# Altium schematic sheet Pg1.SchDoc
size A3; SheetNumber: 1; SheetTotal: 7; SPICEModelCacheZVIZADMF: <root> / <DocumentId>ZVIZADMF</DocumentId> / </root>
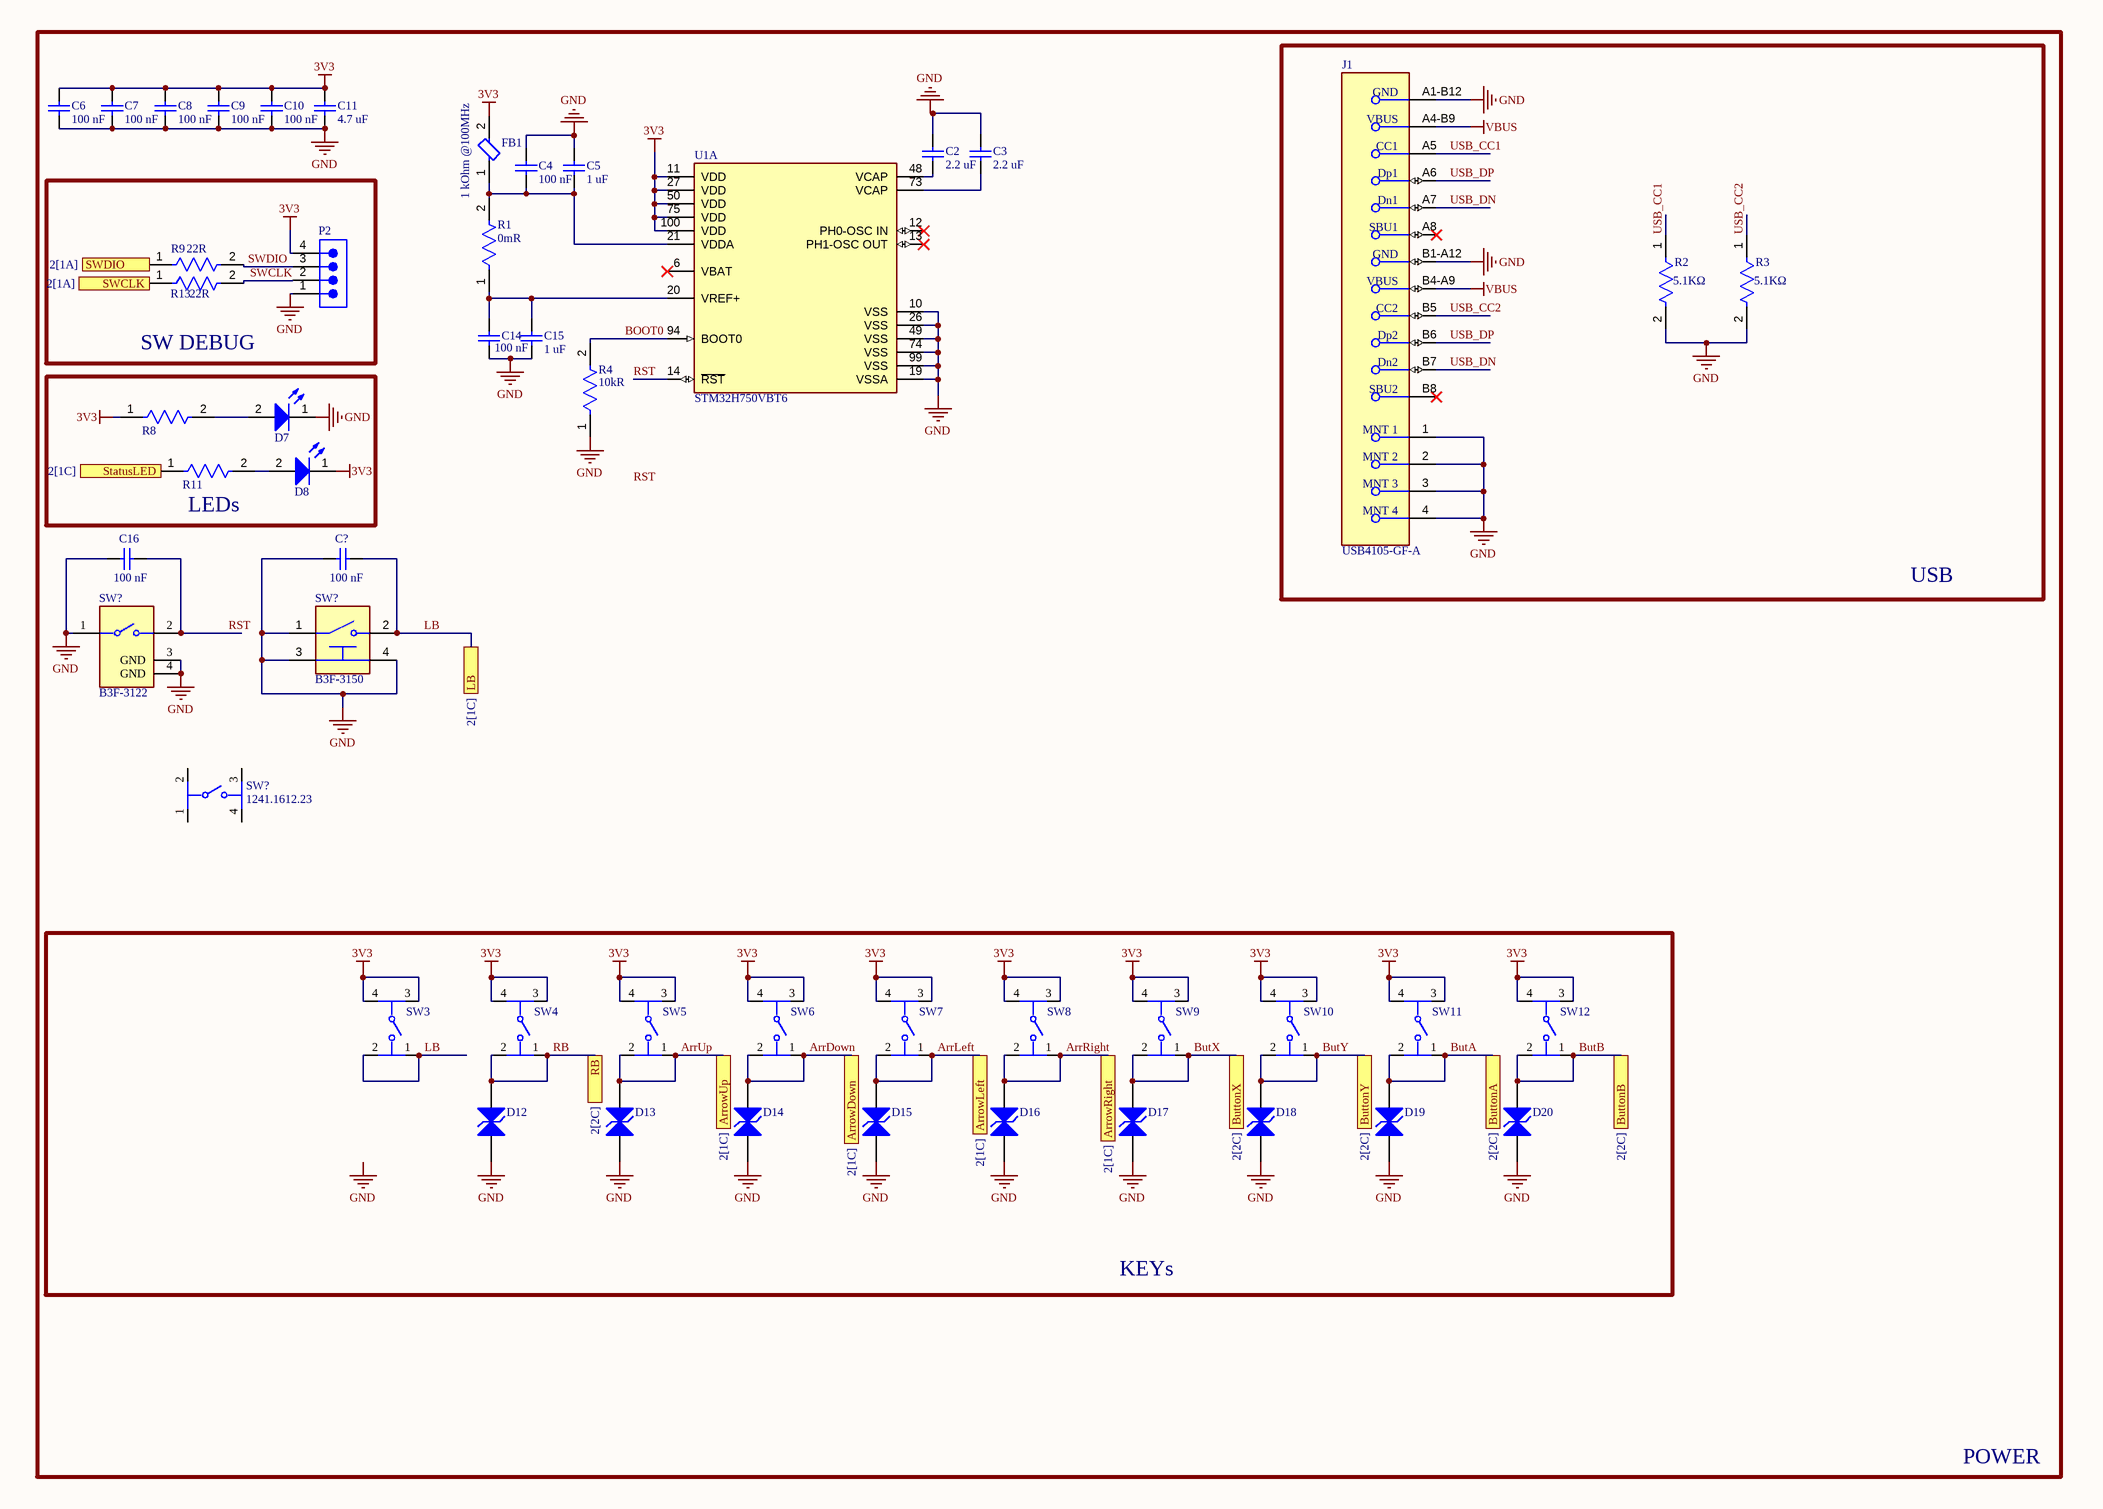
[diagram p0: Pg1.SchDoc]

## Parts
(Parts that share a designator on the sheet are numbered #1, #2 ... from top to bottom, then left to right.)
C2  value 2.2 uF  [CAPC2013X135X45LL10T25]  (hidden comment: GRM21BR60J225KA01K)
C3  value 2.2 uF  [CAPC2013X135X45LL10T25]  (hidden comment: GRM21BR60J225KA01K)
C4  value 100 nF  [CAPC2013X145X50LL20T25]  (hidden comment: C0805C104K9RACTU)
C5  value 1 uF  [CAPC2013X135X45LL10T25]  (hidden comment: GRM21BR60J225KA01K)
C6  value 100 nF  [CAPC2013X145X50LL20T25]  (hidden comment: C0805C104K9RACTU)
C7  value 100 nF  [CAPC2013X145X50LL20T25]  (hidden comment: C0805C104K9RACTU)
C8  value 100 nF  [CAPC2013X145X50LL20T25]  (hidden comment: C0805C104K9RACTU)
C9  value 100 nF  [CAPC2013X145X50LL20T25]  (hidden comment: C0805C104K9RACTU)
C10  value 100 nF  [CAPC2013X145X50LL20T25]  (hidden comment: C0805C104K9RACTU)
C11  value 4.7 uF  [CAPC2013X145X50NL20T25]  (hidden comment: C0805C475K9PACTU)
C14  value 100 nF  [CAPC2013X145X50LL20T25]  (hidden comment: C0805C104K9RACTU)
C15  value 1 uF  [CAPC2013X135X45LL10T25]  (hidden comment: GRM21BR60J225KA01K)
C16  value 100 nF  [CAPC2013X145X50LL20T25]  (hidden comment: C0805C104K9RACTU)
C?  value 100 nF  [CAPC2013X145X50LL20T25]  (hidden comment: C0805C104K9RACTU)
D7  150080BS75000  [WL-SMCW_0805_150080xx75000]  (value not drawn)
D8  150080BS75000  [WL-SMCW_0805_150080xx75000]  (value not drawn)
D12  SMAJ5.0CA-E3/5A  [VISH-DO-214AC-2_N]  (value not drawn)
D13  SMAJ5.0CA-E3/5A  [VISH-DO-214AC-2_N]  (value not drawn)
D14  SMAJ5.0CA-E3/5A  [VISH-DO-214AC-2_N]  (value not drawn)
D15  SMAJ5.0CA-E3/5A  [VISH-DO-214AC-2_N]  (value not drawn)
D16  SMAJ5.0CA-E3/5A  [VISH-DO-214AC-2_N]  (value not drawn)
D17  SMAJ5.0CA-E3/5A  [VISH-DO-214AC-2_N]  (value not drawn)
D18  SMAJ5.0CA-E3/5A  [VISH-DO-214AC-2_N]  (value not drawn)
D19  SMAJ5.0CA-E3/5A  [VISH-DO-214AC-2_N]  (value not drawn)
D20  SMAJ5.0CA-E3/5A  [VISH-DO-214AC-2_N]  (value not drawn)
FB1  value 1 kOhm @100MHz  [FP-BLM21-0_2-t0_85-e0_5-d-IPC_A]  (hidden comment: BLM21SP102SN1D)
J1  USB4105-GF-A  [FP-USB4105-GF-A-MFG]
P2  TSW-104-08-L-S  [SMTC-TSW-104-08-X-S]  (value not drawn)
R1  Resistance: 0mR  [FP-RK73Z2A-MFG]  (hidden comment: RK73Z2ATTD)
R2  value 5.1KΩ  [FP-RT0805-MFG]  (hidden comment: RT0805DRE075K1L)
R3  Resistance: 5.1KΩ  [FP-RT0805-MFG]  (hidden comment: RT0805DRE075K1L)
R4  Resistance: 10kR  [FP-MCU0805-IPC_C]  (hidden comment: MCU08050D1002BP100)
R8  RT0805CRE075K1L  [FP-RT0805-MFG]  (value not drawn)
R9  Resistance: 22R  [FP-RG2012-IPC_B]  (hidden comment: RG2012Q-220-D-T5)
R11  RT0805CRE075K1L  [FP-RT0805-MFG]  (value not drawn)
R13  Resistance: 22R  [FP-RG2012-IPC_B]  (hidden comment: RG2012Q-220-D-T5)
SW3  1571626-8  [FP-1571626-8-MFG]  (value not drawn)
SW4  1571626-8  [FP-1571626-8-MFG]  (value not drawn)
SW5  1571626-8  [FP-1571626-8-MFG]  (value not drawn)
SW6  1571626-8  [FP-1571626-8-MFG]  (value not drawn)
SW7  1571626-8  [FP-1571626-8-MFG]  (value not drawn)
SW8  1571626-8  [FP-1571626-8-MFG]  (value not drawn)
SW9  1571626-8  [FP-1571626-8-MFG]  (value not drawn)
SW10  1571626-8  [FP-1571626-8-MFG]  (value not drawn)
SW11  1571626-8  [FP-1571626-8-MFG]  (value not drawn)
SW12  1571626-8  [FP-1571626-8-MFG]  (value not drawn)
SW?#1  B3F-3122  [FP-B3F-3122-MFG]
SW?#2  B3F-3150  [FP-B3F-3150-MFG]
SW?#3  1241.1612.23  [FP-1241_1612_23-MFG]
U1  STM32H750VBT6  [FP-LQFP100-1L-MFG]  (part A of 3)

## Blocks framed on the sheet
USB: J1 R2 R3
SW DEBUG: P2 R9 R13
LEDs: D7 D8 R8 R11
KEYs: D12-D20 SW3-SW12

## Ports
ArrowDown (see 2[1C]), ArrowLeft (see 2[1C]), ArrowRight (see 2[1C]), ArrowUp (see 2[1C]), ButtonA (see 2[2C]), ButtonB (see 2[2C]), ButtonX (see 2[2C]), ButtonY (see 2[2C]), LB (see 2[1C]), RB (see 2[2C]), StatusLED (see 2[1C]), SWCLK (see 2[1A]), SWDIO (see 2[1A])

## Nets
3V3: C6.2 C7.2 C8.2 C9.2 C10.2 C11.2 D8.1(K) FB1.2 P2.4 R8.1 SW3.3 SW3.4 SW4.3 SW4.4 SW5.3 SW5.4 SW6.3 SW6.4 SW7.3 SW7.4 SW8.3 SW8.4 SW9.3 SW9.4 SW10.3 SW10.4 SW11.3 SW11.4 SW12.3 SW12.4 U1.11(VDD) U1.27(VDD) U1.50(VDD) U1.75(VDD) U1.100(VDD)
GND: C2.2 C3.2 C4.2 C5.2 C6.1 C7.1 C8.1 C9.1 C10.1 C11.1 C14.1 C15.1 C16.1 C?.1 D7.1(K) D12.2(A2) D13.2(A2) D14.2(A2) D15.2(A2) D16.2(A2) D17.2(A2) D18.2(A2) D19.2(A2) D20.2(A2) J1.1(MNT_1) J1.2(MNT_2) J1.3(MNT_3) J1.4(MNT_4) J1.A1-B12(GND) J1.B1-A12(GND) P2.1 R2.2 R3.2 R4.1 SW?#1.1 SW?#1.3(GND) SW?#1.4(GND) SW?#2.1 SW?#2.3(MNT_1) SW?#2.4(MNT_2) U1.10(VSS) U1.19(VSSA) U1.26(VSS) U1.49(VSS) U1.74(VSS) U1.99(VSS)
VBUS: J1.A4-B9(VBUS) J1.B4-A9(VBUS)
ArrDown: D14.1(A1) SW6.1 SW6.2 ; port ArrowDown
ArrLeft: D15.1(A1) SW7.1 SW7.2 ; port ArrowLeft
ArrRight: D16.1(A1) SW8.1 SW8.2 ; port ArrowRight
ArrUp: D13.1(A1) SW5.1 SW5.2 ; port ArrowUp
BOOT0: R4.2 U1.94(BOOT0)
ButA: D19.1(A1) SW11.1 SW11.2 ; port ButtonA
ButB: D20.1(A1) SW12.1 SW12.2 ; port ButtonB
ButX: D17.1(A1) SW9.1 SW9.2 ; port ButtonX
ButY: D18.1(A1) SW10.1 SW10.2 ; port ButtonY
LB: C?.2 SW3.1 SW3.2 SW?#2.2 ; port LB
RB: D12.1(A1) SW4.1 SW4.2 ; port RB
RST: C16.2 SW?#1.2 U1.14(~{RST})
StatusLED: R11.1 ; port StatusLED
SWCLK: P2.2 R13.2
SWCLK: R13.1 ; port SWCLK  [a separate net that carries the same name]
SWDIO: P2.3 R9.2
SWDIO: R9.1 ; port SWDIO  [a separate net that carries the same name]
USB_CC1: J1.A5(CC1) R2.1
USB_CC2: J1.B5(CC2) R3.1
USB_DN: J1.A7(Dn1) J1.B7(Dn2)
USB_DP: J1.A6(Dp1) J1.B6(Dp2)
NetC2_1: C2.1 U1.48(VCAP)
NetC3_1: C3.1 U1.73(VCAP)
NetC4_1: C4.1 C5.1 FB1.1 R1.2 U1.21(VDDA)
NetC14_2: C14.2 C15.2 R1.1 U1.20(VREF+)
NetD7_2: D7.2(A) R8.2
NetD8_2: D8.2(A) R11.2

Not connected (* = marked no-connect by the designer): J1 A8(SBU1)* B8(SBU2)*; SW?#3 1 2 3 4; U1 6(VBAT)* 12(PH0-OSC_IN)* 13(PH1-OSC_OUT)*

## Notes on the sheet
- POWER
- Labels drawn without touching a wire or pin: GND, RST
- DWG NO:
- REV:
- THIS DOCUMENT AND THE DATA DISCLOSED HEREIN OR
- HEREWITH IS THE PROPERTY OF ALTIUM LIMITED AND MAY
- BE FREELY DISTRIBUTED IN WHOLE. NO RIGHTS ARE
- RESERVED OR EXPRESS OR IMPLIED WARANTEE GIVEN.
- REVISION
- DESCRIPTION
- DATE
- APPROVED
- ENG:
- APPROVALS
- PROJECT
- DSN:
- CHK:
- REFERENCE DOCUMENTS
- PROJECT REVISION:
- TITLE
- DOCUMENT REVISION:
- DESIGN ITEM:
- BOM:
- FAB DWG:
- PCB DWG:
- ASSY DWG:
- SCALE:
- A2
- SIZE
- CAGE CODE
- FILE NAME
- DWG NO.
- SHEET
- OF
- REV

## Library data of the parts
C2 C3 C5 C15 = CMP-2007-03531-1: Manufacturer: Murata; Part Number: GRM21BR60J225KA01K
C4 C6-C10 C14 C16 C? = CMP-1036-04391-2: Manufacturer: Kemet; Part Number: C0805C104K9RACTU
C11 = CMP-2007-01009-1: Manufacturer: Kemet; Part Number: C0805C475K9PACTU
D7 D8 = CMP-1426-00008-7: Led, Blue, 470 Nm, 3.2 V, 30 Ma, 145 Mcd Rohs Compliant: Yes; Dominant Wavelength: 470nm; Max Junction Temperature (Tj): 95°C; Power Dissipation: 105mW; Peak Wavelength: 465nm; Max Reverse Voltage (DC): 5V; Forward Current: 100mA; Test Current: 20mA; Luminous Intensity: 145mcd; Lens Style: Clear, Rectangular; Viewing Angle: 140°; Forward Voltage: 3.2V; Color: Blue; Height: 700µm; Case Code (Imperial): 0805; Width: 1.25mm; REACH SVHC: Unknown; Case/Package: 0805; Lead Free: Lead Free; Mount: Surface Mount; Packaging: Tape and Reel; RoHS: Compliant; Reverse Voltage: 5V; Min Operating Temperature: -40°C; Case Code (Metric): 2012; Wavelength: 470nm; Max Operating Temperature: 85°C; Length: 2mm
D12-D20 = CMP-0548-00276-2: Transient Voltage Suppressor, 6.40 to 231 V, 5 V Stand-off Voltage, Bi-Directional, -55 to 155 degC, 2-pin DO-214AC, Pb-Free, Tape and Reel; Manufacturer: Vishay Semiconductor; PPPM (W): 400, 300; VBR Bi-Directional (V): 6.4 to 231; ID (uA): 1600; IFSM: 40 A; VWM (V): 5; RoHS: TRUE; Operating Junction and Storage Temperature Range: -55 to 150 degC; Packing: Tape and Reel; ComponentLink1URL: http://www.vishay.com/; Mounting Technology: Surface Mount; ComponentLink2URL: http://www.vishay.com/docs/88390/smaj50a.pdf; PartNumber: SMAJ5.0CA-E3/5A; PackageReference: DO-214AC-2; ComponentLink1Description: Manufacturer URL; ComponentLink3Description: Package Specification; ComponentLink2Description: Datasheet; PackageDescription: 2-Pin DO-214AC (SMA), Body 4.245 x 2.665 mm; DatasheetVersion: 12/8/2013; ComponentLink3URL: http://www.vishay.com/docs/88390/smaj50a.pdf
FB1 = CMP-06046-001860-1: Chip Ferrite Bead, 0805, 1000Ω @ 100MHz, 0.12Ω, 25%, 1.6A; RoHS Compliant: Yes
J1 = CMP-245163-000001-1: CONN RCPT USB2.0 TYPEC 5A; Manufacturer: GCT; Voltage Rating: 20V; Is Female: yes; Current Rating: 5/6.25/1.25/0.25A; Number Of Contacts: 16; Conn Orientation: Right Angle; Device Class L1: Connectors; Category: Conn; Lead Free: Yes; RoHS: TRUE; Temperature Range High: +85°C; Digikey Description: CONN RCPT USB2.0 TYPEC 5A; Device Class L3: unset; ComponentLink2Description: Datasheet; Manufacturer Part Number: USB4105-GF-A; Package: 0; Usb Standard: USB 2.0; Device Class L2: USB Connectors; Automotive: No; Temperature Range Low: -40°C; Height: 3.46mm; Temperature: -40°C to +85°C; Contact Material: Gold,Nickel; ComponentLink2URL: https://gct.co/files/drawings/usb4105.pdf; Octopart: https://octopart.com/usb4105-gf-a-gct-106627878
P2 = CMP-1024-00358-1: 0.025" SQ Post Header, Through-hole, Vertical, -55 to 125 degC, 2.54 mm Pitch, 4-Pin, Male, RoHS; Manufacturer: Samtec; Pitch: 2.54 mm; PartNumber: TSW-104-08-L-S; RoHS: True; Temperature Range: -55 to 125 degC; PackageDescription: .025[0.64] SQ. Post Terminal Strip Assembly; Orientation: Vertical; ComponentLink2URL: http://www.samtec.com/documents/webfiles/pdf/TSW_TH.PDF; ComponentLink1Description: Manufacturer URL; ComponentLink2Description: Datasheet; PackageVersion: DM, 8/1988; ComponentLink3URL: http://www.samtec.com/documents/webfiles/cpdf/TSW-XXX-XX-XXX-X-XX-XXX-MKT.pdf; Mounting Technology: Through-hole; PackageReference: TSW-104-08-X-S; ComponentLink3Description: Package Specification; ComponentLink1URL: http://www.samtec.com; DatasheetVersion: F-214
R1 = CMP-2000-05462-2: RES 0 OHM JUMPER 0805; Temperature Coefficient: 400ppm/°C; Tolerance: 1%; Power Rating: 2W; Min Operating Temperature: -55°C; Termination: SMD/SMT; Width: 1.25mm; Series: RK73Z; Lead Free: Lead Free; Case Code (Metric): 2012; Military Standard: Not; Case Code (Imperial): 0805; Packaging: Tape and Reel; Max Operating Temperature: 155°C; Package Quantity: 5000; Height: 0.5mm; RoHS Compliant: Yes; Depth: 1.25mm; Length: 2mm; Resistor Type: Thick Film; Case/Package: 0805; Construction: Rectangular
R2 = CMP-03412-022555-1: RES SMD 5.1K OHM 0.5% 1/8W 0805; Manufacturer: Yageo; Temperature Coefficient: 50 ppm/°C; Tolerance: 0.01; Voltage Rating: 150V; Power Rating: 0.125W; Manufacturer Part Number: RT0805DRE075K1L; Device Class L3: Chip SMD Resistors; Digikey Description: RES SMD 5.1K OHM 0.5% 1/8W 0805; Series: RT; ComponentLink2URL: http://www.yageo.com/documents/recent/PYu-RT_1-to-0.01_RoHS_L_9.pdf; Lead Free: Yes; Octopart: https://octopart.com/rt0805dre075k1l-yageo-1467682; ComponentLink2Description: Datasheet; Temperature Range High: +155°C; Temperature Range Low: -55°C; Resistance: 5.1KΩ; Composition: Thin Film; Height: 0.6mm; Device Class L2: Resistors; Ipc Land Pattern Name: RESC200125X50; Package: RT0805; Category: Res; Footprint Url: http://www.yageo.com/exep/pages/download/literatures/PYu-R_Mount_10.pdf; Temperature: -55°C to +155°C; RoHS: TRUE; Automotive: No; Device Class L1: Passive Components
R3 = CMP-03412-022555-1: RES SMD 5.1K OHM 0.5% 1/8W 0805; Manufacturer: Yageo; Temperature Coefficient: 50 ppm/°C; Value: 5.1KΩ; Tolerance: 0.01; Voltage Rating: 150V; Power Rating: 0.125W; Manufacturer Part Number: RT0805DRE075K1L; Device Class L3: Chip SMD Resistors; Digikey Description: RES SMD 5.1K OHM 0.5% 1/8W 0805; Series: RT; ComponentLink2URL: http://www.yageo.com/documents/recent/PYu-RT_1-to-0.01_RoHS_L_9.pdf; Lead Free: Yes; Octopart: https://octopart.com/rt0805dre075k1l-yageo-1467682; ComponentLink2Description: Datasheet; Temperature Range High: +155°C; Temperature Range Low: -55°C; Composition: Thin Film; Height: 0.6mm; Device Class L2: Resistors; Ipc Land Pattern Name: RESC200125X50; Package: RT0805; Category: Res; Footprint Url: http://www.yageo.com/exep/pages/download/literatures/PYu-R_Mount_10.pdf; Temperature: -55°C to +155°C; RoHS: TRUE; Automotive: No; Device Class L1: Passive Components
R4 = CMP-02407-010458-1: RES 1.05K OHM 0.5% 1/5W 0805; Power Rating: 125mW; Voltage Rating (DC): 100V; Tolerance: 0.1%; Temperature Coefficient: 25ppm/°C; Min Operating Temperature: -55°C; Military Standard: Not; Composition: Thin Film; Max Power Dissipation: 125mW; Lead Free: Lead Free; Case/Package: 0805; Contact Plating: Tin; Depth: 1.25mm; Number of Terminations: 2; Height: 0.022inch; Package Quantity: 1000; Max Operating Temperature: 125°C; Packaging: Tape and Reel; Mount: Surface Mount; Radiation Hardening: No; Length: 2mm; Width: 0.049inch
R8 R11 = CMP-03412-005622-1: RES SMD 5.1K OHM 0.25% 1/8W 0805; Manufacturer: Yageo; Tolerance: 0.005; Value: 5.1KΩ; Voltage Rating: 150V; Power Rating: 0.125W; Temperature Coefficient: 50 ppm/°C; Temperature Range Low: -55°C; Device Class L3: Chip SMD Resistors; Series: RT; Automotive: No; Height: 0.6mm; Lead Free: Yes; Category: Res; ComponentLink2Description: Datasheet; ComponentLink2URL: http://www.yageo.com/documents/recent/PYu-RT_1-to-0.01_RoHS_L_9.pdf; Composition: Thin Film; Temperature Range High: +155°C; Device Class L1: Passive Components; Footprint Url: http://www.yageo.com/exep/pages/download/literatures/PYu-R_Mount_10.pdf; Package: RT0805; Device Class L2: Resistors; Resistance: 5.1KΩ; RoHS: TRUE; Digikey Description: RES SMD 5.1K OHM 0.25% 1/8W 0805; Temperature: -55°C to +155°C; Manufacturer Part Number: RT0805CRE075K1L; Octopart: https://octopart.com/rt0805cre075k1l-yageo-1479639; Ipc Land Pattern Name: RESC200125X50
R9 R13 = CMP-28537-003551-1: Automotive Metal Thin Film Chip Resistor, 0805, 22Ω, 0.5%, 50ppm/°C, 0.125W, 150V; Power Rating: 125mW; Length: 2mm; Features: Automotive AEC-Q200; Tolerance: 0.5%; Packaging: Tape and Reel; Case/Package: 0805; Termination: SMD/SMT; Weight: 0.000194oz; Height: 0.4mm; Voltage Rating (DC): 150V; Voltage Rating: 150V; RoHS Compliant: Yes; Case Code (Imperial): 0805; Lead Free: Lead Free; Min Operating Temperature: -55°C; Resistor Type: Thin Film; Series: RG; Max Power Dissipation: 125mW; Max Operating Temperature: 155°C; Width: 1.2mm; Temperature Coefficient: 50ppm/°C; Case Code (Metric): 2012; Number of Terminations: 2
SW3-SW12 = CMP-03407-000021-1: SWITCH TACTILE SPST-NO 0.05A 12V; Max Current Rating: 50mA; Actuator Material: Nylon; Throw Configuration: SPST; Actuator Length: 0.711mm; Actuator Type: Standard; Operating Force: 1.57N; Voltage Rating (DC): 24V; Switch Function: Off-Mom; Illumination Type: Non-Illuminated; Mount: Surface Mount; Contact Plating: Silver; Contact Material: Stainless Steel; Depth: 8.2mm; Termination: Gull Wing; Type: Switch; Length: 6.2mm; Max Operating Temperature: 85°C; ELV: Compliant; Radiation Hardening: No; Orientation: Straight; Series: Extended Life; Packaging: Tape and Reel; Package Quantity: 2000; Max Voltage Rating (DC): 12V; Contact Current Rating: 50mA; Min Operating Temperature: -20°C; Current Rating: 50mA; Material: Polyamide; Housing Material: Polymer; Case/Package: SMD/SMT
SW?#1 = CMP-08834-000053-1: SWITCH TACTILE SPST-NO 0.05A 24V; Max Current Rating: 50mA; Actuator Type: Standard; Ratings: IP00; Number of Poles: 1; Mechanical Life: 300000Cycles; Illumination Type: Non-Illuminated; Switch Function: Off-Mom; Actuator Color: Grey; Contact Resistance: 100mR; Throw Configuration: SPST; Actuator Length: 1.6mm; Switch Travel: 0.25mm; Operating Force: 1.47N; Weight: 0.25g; Voltage Rating (DC): 24V; Contact Plating: Gold; RoHS Compliant: Yes; Contact Material: Gold; Radiation Hardening: No; Packaging: Bulk; Height: 7.4mm; Min Operating Temperature: -25°C; Electrical Life: 300000Cycles; Depth: 7.85mm; Max Voltage Rating (DC): 24V; Mount: Through Hole; Width: 6.25mm; Current Rating: 50mA; Lead Free: Lead Free; Max Operating Temperature: 70°C; Series: B3F; Contact Current Rating: 50mA; Package Quantity: 1000; Termination: PC Pins; Orientation: Right Angle; Length: 7.3mm
SW?#2 = CMP-08834-000006-1: SWITCH TACTILE SPST-NO 0.05A 24V; Manufacturer: Omron; Contact Current Rating: 50mA; Electromechanical Life: 1000000Cycles; Description: Tactile Switch SPST-NO Side Actuated Through Hole, Right Angle; Contact Resistance: 100mΩ; Operating Force: 0.98N; Octopart: https://octopart.com/b3f-3150-omron-49234; Device Class L1: Electromechanical; Device Class L2: Switches; Temperature Range Low: -25°C; Temperature Range High: +70°C; Mouser Description: Tactile Switches R/A 6X6 6.15mm BTN; Temperature: -25°C to +70°C; Voltage Rating Dc: 24V; Automotive: No; Ambient Temperature Range Low: -25°C; Ambient Temperature Range High: +70°C; Mount: Through Hole; ComponentLink2URL: https://omronfs.omron.com/en_US/ecb/products/pdf/en-b3f.pdf; RoHS: TRUE; ComponentLink2Description: Datasheet; Digikey Description: SWITCH TACTILE SPST-NO 0.05A 24V; Package: 0; Height: 7.8mm; Throw Configuration: SPST-NO; Lead Free: Yes; Device Class L3: Tactile Switches; Category: Switch; Manufacturer Part Number: B3F-3150
SW?#3 = CMP-26321-000007-1: SWITCH TACTILE SPST-NO 0.05A 42V; Max Current Rating: 50mA; Voltage Rating (AC): 30V; Switch Function: Off-Mom; Illumination Type: Non-Illuminated; Mechanical Life: 1000000Cycles; Actuator Type: Standard; Ratings: IP40; Switch Travel: 0.35mm; Actuator Material: Polyphenylene; Operating Force: 1.6N; Throw Configuration: SPST; Contact Plating: Gold; Mount: Surface Mount; Contact Material: Gold; Termination: Gull Wing; Min Operating Temperature: -40°C; Series: SMS; Depth: 15.9mm; Radiation Hardening: No; Lead Free: Lead Free; Max Operating Temperature: 85°C; Length: 11.4mm; Voltage Rating (DC): 42V; Current Rating: 50mA; Packaging: Tape and Reel; Housing Material: Polyamide; Package Quantity: 450; Max Voltage Rating (AC): 30V; Orientation: Straight; Weight: 0.070548oz; Max Voltage Rating (DC): 42V
U1 = CMP-12105-000017-1: IC MCU 32BIT 128KB FLASH 100LQFP; Manufacturer: STMicroelectronics; Number Of Uart Channels: 9; Number Of I/Os: 82; Max Junction Temp: +125°C; Data Bus Width: 32bits; Ram Size: 1MBytes; Min Supply Voltage: 1.62V; Number Of Spi Channels: 6; Number Of Adc Channels: 36; Max Supply Voltage: 3.6V; Standoff Height: 0.05mm; Interface: I2C,SPI,UART,USART,CAN,USB,LIN,IrDA,Ethernet,I2S,Other; Number Of A/D Converters: 3; Number Of I2C Channels: 4; Memory Size: 128KBytes; Frequency: 480MHz; Number Of Timers/Counters: 20; Number Of Ethernet Channels: 1; Core Architecture: ARM Cortex-M7; Number Of Usb Channels: 2; Number Of Pwm Channels: 42; Ambient Temperature Range High: +85°C; Temperature: -40°C to +125°C; ComponentLink2URL: https://www.st.com/resource/en/datasheet/stm32h750vb.pdf; Device Class L2: Embedded Processors and Controllers; Temperature Range Low: -40°C; Octopart: https://octopart.com/stm32h750vbt6-stmicroelectronics-94048547; Category: IC; Manufacturer Part Number: STM32H750VBT6; Height: 1.6mm; Lead Free: Yes; Device Class L1: Integrated Circuits (ICs); Digikey Description: IC MCU 32BIT 128KB FLASH 100LQFP; RoHS: TRUE; Ambient Temperature Range Low: -40°C; Device Class L3: Microcontrollers; ComponentLink2Description: Datasheet; Mouser Description: MCU 32-Bit STM32H750VB ARM Cortex M7 RISC 128KB Flash 1.8V/2.5V/3.3V 100-Pin LQFP Tray; Number Of Cores: 1; Automotive: No; Memory Type: FLASH; Package: LQFP100-1L; Temperature Range High: +125°C